# Altium project KSS_4_info_LED.PrjPcb
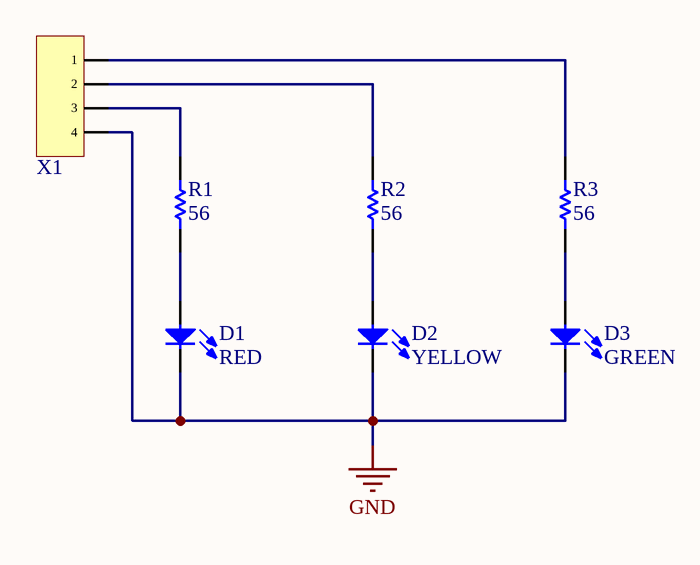
[diagram p0: KSS_4_info_LED.SchDoc]
1 sheet, 7 parts. Net scope: global (net labels, ports and power ports of the same name join across sheets).
Board file: KSS_4_info_LED.PcbDoc

## Sheet KSS_4_info_LED.SchDoc
size A4; SheetNumber: 1; SheetTotal: 1

### Parts
D1  RED  [LED_RED_3mm]
D2  YELLOW  [LED_YELLOW_3mm]
D3  GREEN  [LED_GREEN_3mm]
R1  Resistance: 56  [RES_0603]  (hidden comment: Resistor)
R2  Resistance: 56  [RES_0603]  (hidden comment: Resistor)
R3  Resistance: 56  [RES_0603]  (hidden comment: Resistor)
X1  HEADER_X4  [HEADER_1X4_M]  (value not drawn)

### Nets
GND: D1.2(K) D2.2(K) D3.2(K) X1.4
NetD1_1: D1.1(A) R1.1
NetD2_1: D2.1(A) R2.1
NetD3_1: D3.1(A) R3.1
NetR1_2: R1.2 X1.3
NetR2_2: R2.2 X1.2
NetR3_2: R3.2 X1.1

### Library data of the parts
D1-D3 = Diode LED